# EAGLE design Arachnio (EAGLE 6.5.0)

## Sheet 1 of 4
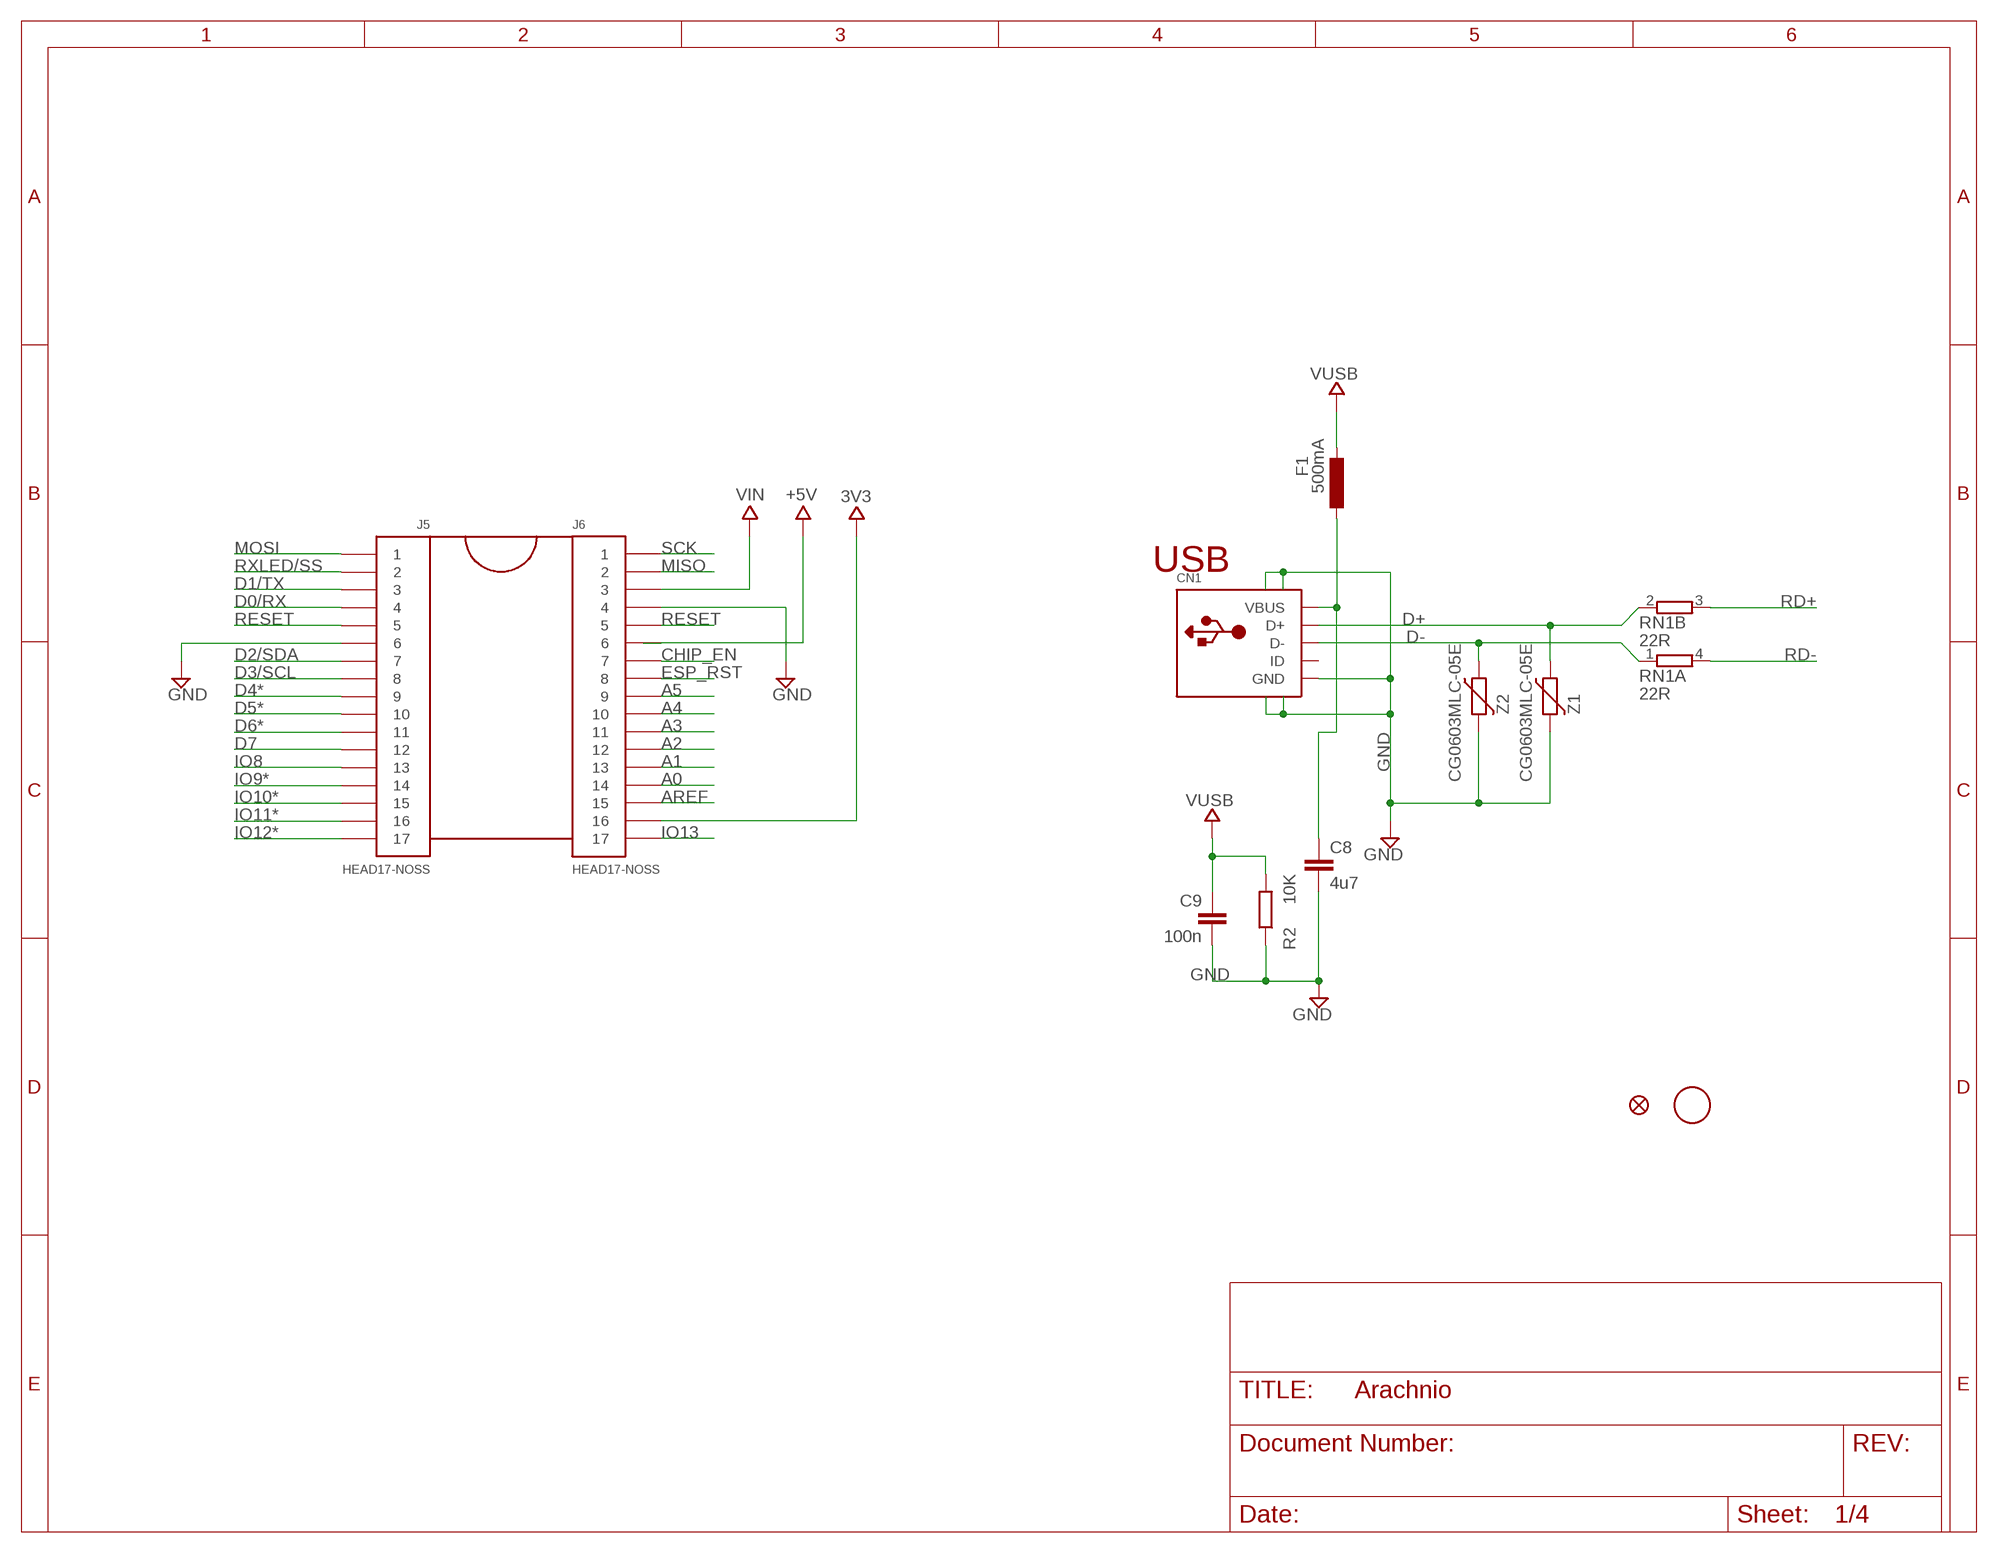
[diagram p0: schematic, sheet 1]

### Parts
C8  4u7  C-EUC0603  [C0603]
C9  100n  C-EUC0603  [C0603]
CN1  USBMINIB  [USB-MINIB]
F1  500mA  L-EUL1812  [L1812]
J5  HEAD17-NOSS  [HEAD17-NOSS]
J6  HEAD17-NOSS  HEAD17-NOSS-1  [HEAD17-NOSS-1]
R2  10K  R-EU_R0603  [R0603]
RN1  22R  2R-NEXBV4V  [EXBV4V]
U$37  FIDUCIALMOUNT  [FIDUCIA-MOUNT]
U$53  FIDUCIAL1X2  [FIDUCIAL-1X2]
Z1  CG0603MLC-05E  VARISTORCN0603  [CT/CN0603]
Z2  CG0603MLC-05E  VARISTORCN0603  [CT/CN0603]

### Nets
3V3: J6.16 ; also sheet 2,3,4
+5V: J6.6 ; also sheet 2,3
A0: J6.14 ; also sheet 2
A1: J6.13 ; also sheet 2
A2: J6.12 ; also sheet 2
A3: J6.11 ; also sheet 2
A4: J6.10 ; also sheet 2
A5: J6.9 ; also sheet 2
AREF: J6.15 ; also sheet 2
CHIP_EN: J6.7 ; also sheet 4
D0/RX: J5.4 ; also sheet 2,4
D1/TX: J5.3 ; also sheet 2,4
D2/SDA: J5.7 ; also sheet 2
D3/SCL: J5.8 ; also sheet 2,4
D4*: J5.9 ; also sheet 2
D5*: J5.10 ; also sheet 2
D6*: J5.11 ; also sheet 2
D7: J5.12 ; also sheet 2
D+: CN1.D+ RN1.2 Z1.1
D-: CN1.D- RN1.1 Z2.1
ESP_RST: J6.8 ; also sheet 4
GND: C8.2 C9.2 CN1.GND CN1.GND1(SHIELD) CN1.GND2(SHIELD) CN1.GND3(SHIELD) CN1.GND4(SHIELD) J5.6 J6.4 R2.1 Z1.2 Z2.2 ; also sheet 2,3,4
IO8: J5.13 ; also sheet 2
IO9*: J5.14 ; also sheet 2
IO10*: J5.15 ; also sheet 2
IO11*: J5.16 ; also sheet 2
IO12*: J5.17 ; also sheet 2
IO13: J6.17 ; also sheet 2
MISO: J6.2 ; also sheet 2
MOSI: J5.1 ; also sheet 2
RD+: RN1.3 ; also sheet 2
RD-: RN1.4 ; also sheet 2
RESET: J5.5 J6.5 ; also sheet 2,4
RXLED/SS: J5.2 ; also sheet 2
SCK: J6.1 ; also sheet 2
VIN: J6.3 ; also sheet 3
VUSB: C9.1 F1.2 R2.2 ; also sheet 2,3
VUSBD: C8.1 CN1.VBUS F1.1
Unconnected: CN1.ID

### Notes on the sheet
- USB

## Sheet 2 of 4
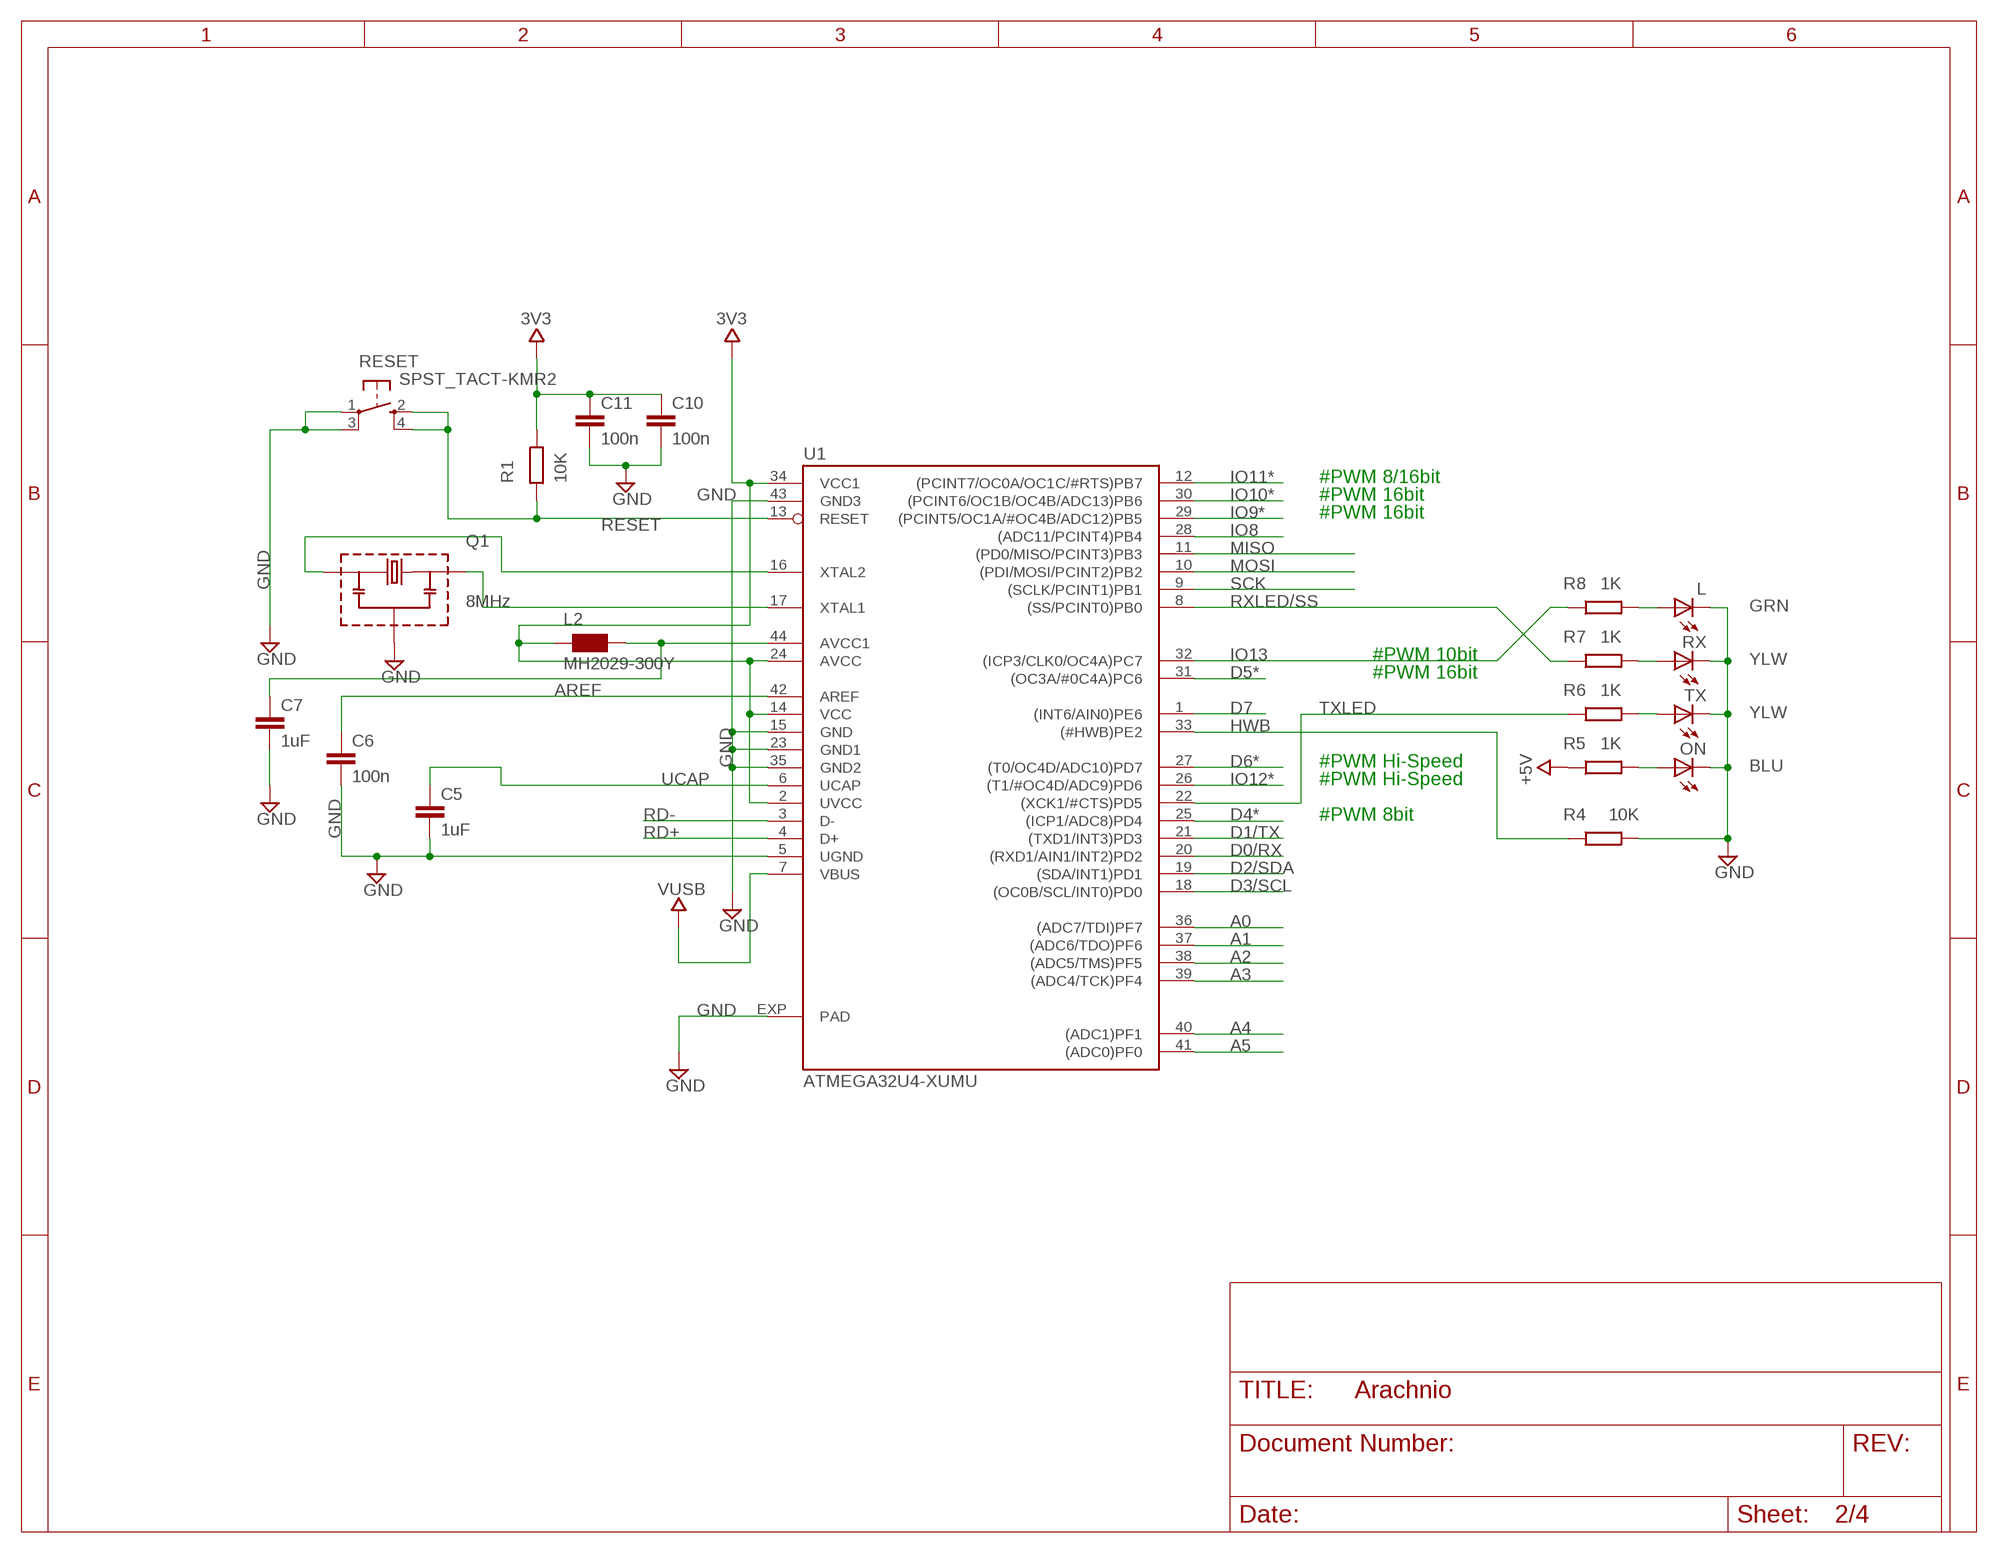
[diagram p1: schematic, sheet 2]

### Parts
C5  1uF  C-EUC0603  [C0603]
C6  100n  C-EUC0603  [C0603]
C7  1uF  C-EUC0603  [C0603]
C10  100n  C-EUC0603  [C0603]
C11  100n  C-EUC0603  [C0603]
L  GRN  LEDCHIP-LED0603  [CHIP-LED0603]
L2  MH2029-300Y  WE-CBF_0805  [0805]
ON  BLU  LEDCHIP-LED0603  [CHIP-LED0603]
Q1  8MHz  PRQC  [PRQC]
R1  10K  R-EU_R0603  [R0603]
R4  10K  R-EU_R0603  [R0603]
R5  1K  R-EU_R0603  [R0603]
R6  1K  R-EU_R0603  [R0603]
R7  1K  R-EU_R0603  [R0603]
R8  1K  R-EU_R0603  [R0603]
RESET  SPST_TACT-KMR2  [KMR2]
RX  YLW  LEDCHIP-LED0603  [CHIP-LED0603]
TX  YLW  LEDCHIP-LED0603  [CHIP-LED0603]
U1  ATMEGA32U4-XUMU  [QFN44ML7X7]

### Nets
3V3: C10.1 C11.1 L2.1 R1.1 U1.2(UVCC) U1.14(VCC) U1.24(AVCC) U1.34(VCC1) ; also sheet 1,3,4
+5V: R5.1 ; also sheet 1,3
A0: U1.36((ADC7/TDI)PF7) ; also sheet 1
A1: U1.37((ADC6/TDO)PF6) ; also sheet 1
A2: U1.38((ADC5/TMS)PF5) ; also sheet 1
A3: U1.39((ADC4/TCK)PF4) ; also sheet 1
A4: U1.40((ADC1)PF1) ; also sheet 1
A5: U1.41((ADC0)PF0) ; also sheet 1
AREF: C6.1 U1.42(AREF) ; also sheet 1
AVCC: C7.1 L2.2 U1.44(AVCC1)
D0/RX: U1.20((RXD1/AIN1/INT2)PD2) ; also sheet 1,4
D1/TX: U1.21((TXD1/INT3)PD3) ; also sheet 1,4
D2/SDA: U1.19((SDA/INT1)PD1) ; also sheet 1
D3/SCL: U1.18((OC0B/SCL/INT0)PD0) ; also sheet 1,4
D4*: U1.25((ICP1/ADC8)PD4) ; also sheet 1
D5*: U1.31((OC3A/#0C4A)PC6) ; also sheet 1
D6*: U1.27((T0/OC4D/ADC10)PD7) ; also sheet 1
D7: U1.1((INT6/AIN0)PE6) ; also sheet 1
GND: C5.2 C6.2 C7.2 C10.2 C11.2 L.C ON.C Q1.P$2 R4.2 RESET.1(P) RESET.3(P1) RX.C TX.C U1.5(UGND) U1.15(GND) U1.23(GND1) U1.35(GND2) U1.43(GND3) U1.EXP(PAD) ; also sheet 1,3,4
HWB: R4.1 U1.33((#HWB)PE2)
IO8: U1.28((ADC11/PCINT4)PB4) ; also sheet 1
IO9*: U1.29((PCINT5/OC1A/#OC4B/ADC12)PB5) ; also sheet 1
IO10*: U1.30((PCINT6/OC1B/OC4B/ADC13)PB6) ; also sheet 1
IO11*: U1.12((PCINT7/OC0A/OC1C/#RTS)PB7) ; also sheet 1
IO12*: U1.26((T1/#OC4D/ADC9)PD6) ; also sheet 1
IO13: R8.1 U1.32((ICP3/CLK0/OC4A)PC7) ; also sheet 1
MISO: U1.11((PD0/MISO/PCINT3)PB3) ; also sheet 1
MOSI: U1.10((PDI/MOSI/PCINT2)PB2) ; also sheet 1
N$2: R7.2 RX.A
N$3: ON.A R5.2
N$4: R6.2 TX.A
N$7: L.A R8.2
RD+: U1.4(D+) ; also sheet 1
RD-: U1.3(D-) ; also sheet 1
RESET: R1.2 RESET.2(S) RESET.4(S1) U1.13(RESET) ; also sheet 1,4
RXLED/SS: R7.1 U1.8((SS/PCINT0)PB0) ; also sheet 1
SCK: U1.9((SCLK/PCINT1)PB1) ; also sheet 1
TXLED: R6.1 U1.22((XCK1/#CTS)PD5)
UCAP: C5.1 U1.6(UCAP)
VUSB: U1.7(VBUS) ; also sheet 1,3
XTAL1: Q1.P$3 U1.17(XTAL1)
XTAL2: Q1.P$1 U1.16(XTAL2)

### Notes on the sheet
- #PWM 8/16bit
- #PWM 16bit
- #PWM 16bit
- #PWM 10bit
- #PWM 16bit
- #PWM Hi-Speed
- #PWM Hi-Speed
- #PWM 8bit

## Sheet 3 of 4
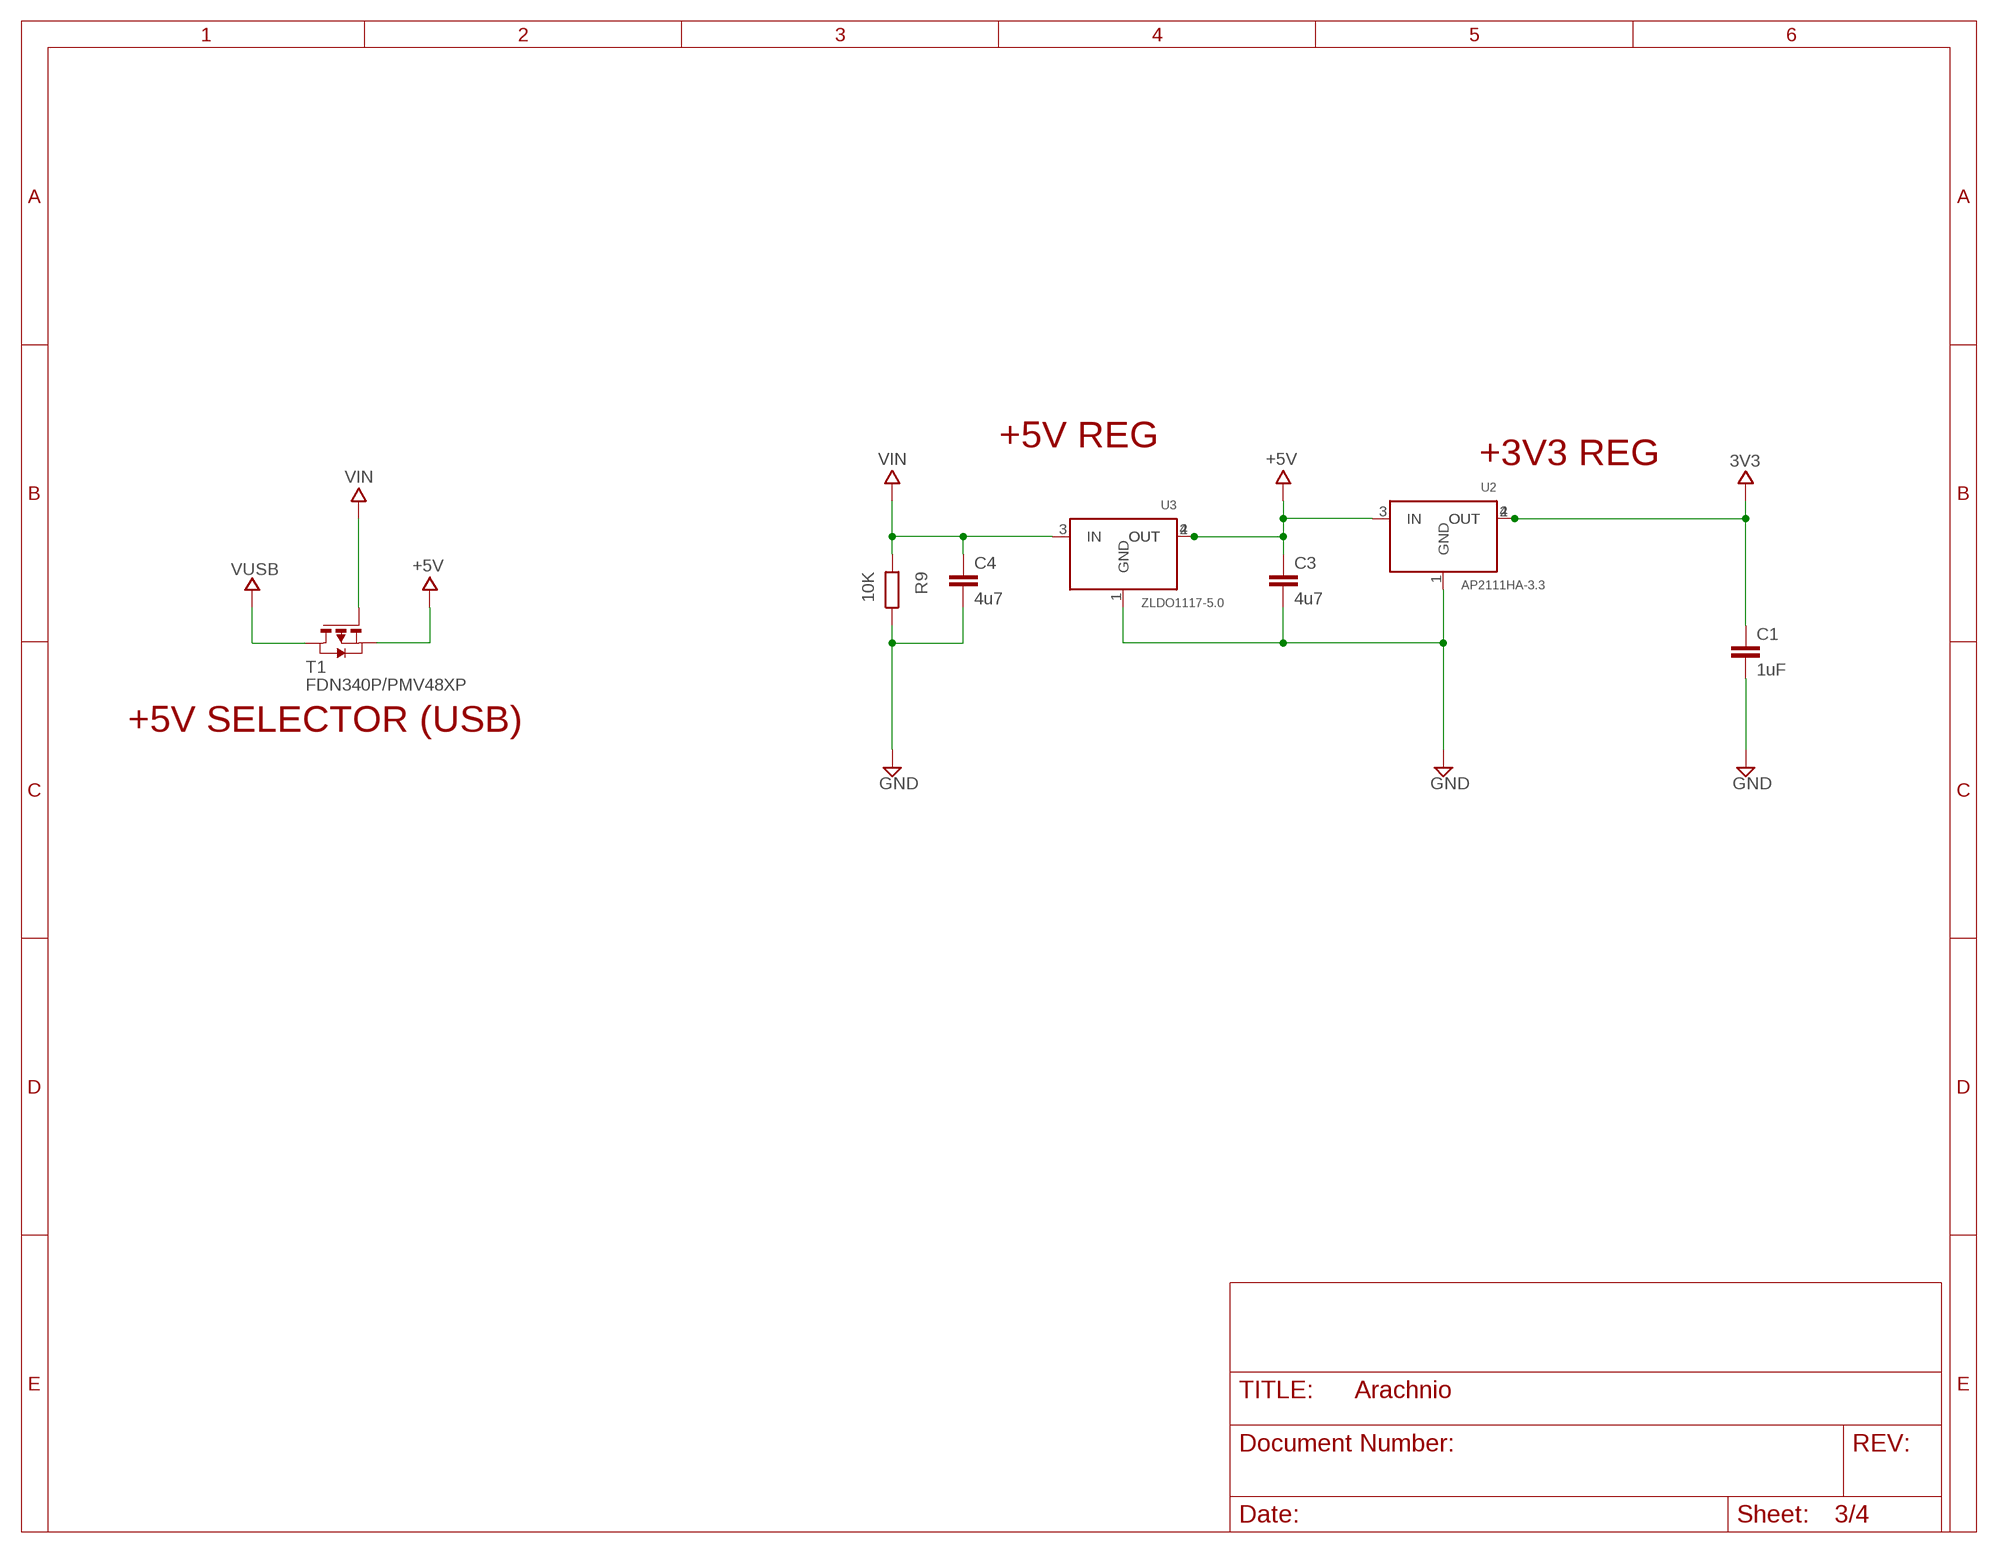
[diagram p2: schematic, sheet 3]

### Parts
C1  1uF  C-EUC0603  [C0603]
C3  4u7  C-EUC0603  [C0603]
C4  4u7  C-EUC0603  [C0603]
R9  10K  R-EU_R0603  [R0603]
T1  FDN340P/PMV48XP  PMOSSOT23  [SOT-23]
U2  AP2111HA-3.3  [SOT223]
U3  ZLDO1117-5.0  [SOT223]

### Nets
3V3: C1.1 U2.2(OUT) U2.4(OUT) ; also sheet 1,2,4
+5V: C3.1 T1.2(S) U2.3(IN) U3.2(OUT) U3.4(OUT) ; also sheet 1,2
GND: C1.2 C3.2 C4.2 R9.1 U2.1(GND) U3.1(GND) ; also sheet 1,2,4
VIN: C4.1 R9.2 T1.3(G) U3.3(IN) ; also sheet 1
VUSB: T1.1(D) ; also sheet 1,2

### Notes on the sheet
- +5V REG
- +3V3 REG
- +5V SELECTOR (USB)

## Sheet 4 of 4
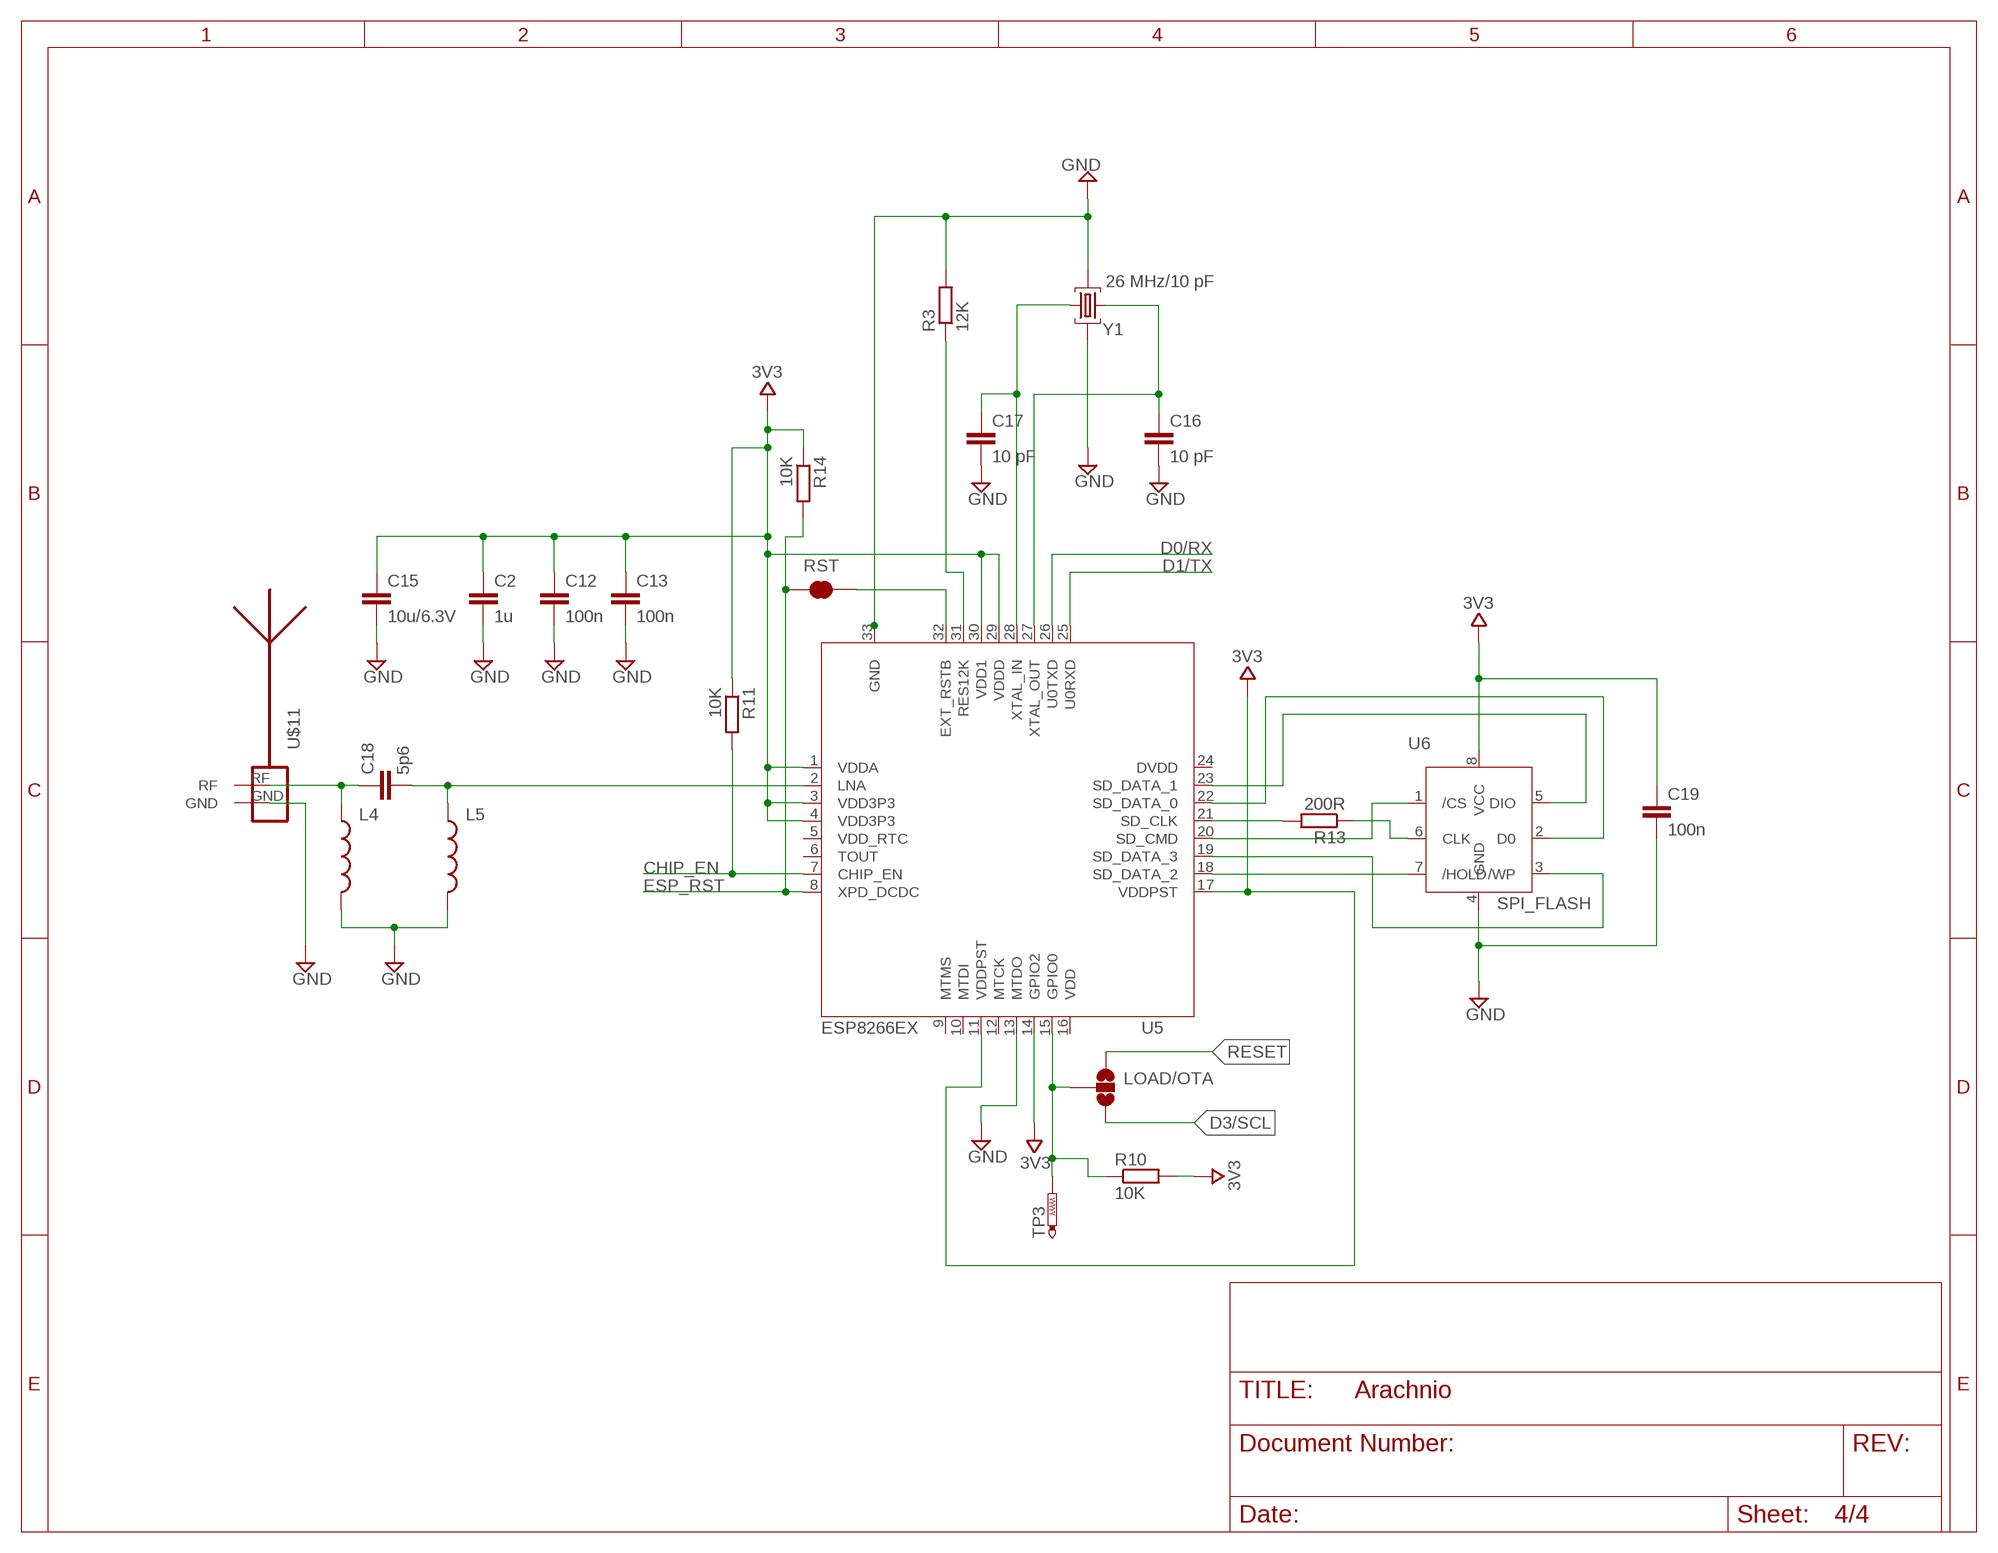
[diagram p3: schematic, sheet 4]

### Parts
C2  1u  C-EUC0603  [C0603]
C12  100n  C-EUC0603  [C0603]
C13  100n  C-EUC0603  [C0603]
C15  10u/6.3V  C-EUC0603  [C0603]
C16  10 pF  C-EUC0603  [C0603]
C17  10 pF  C-EUC0603  [C0603]
C18  5p6  C-EUC0603  [C0603]
C19  100n  C-EUC0603  [C0603]
L4  INDUCTOR0603  [0603]
L5  INDUCTOR0603  [0603]
LOAD/OTA  JUMPER-PAD-3-NOYES_SILK  [PAD-JUMPER-3-NO_YES_SILK]
R3  12K  R-EU_R0603  [R0603]
R10  10K  R-EU_R0603  [R0603]
R11  10K  R-EU_R0603  [R0603]
R13  200R  R-EU_R0603  [R0603]
R14  10K  R-EU_R0603  [R0603]
RST  JUMPER-PAD-2-NC_BY_TRACE  [PAD-JUMPER-2-NC_BY_TRACE_YES_SILK]
TP3  PTR1TP15SQ  [TP15SQ]
U5  ESP8266EX  [QFN32]
U6  SPI_FLASH  [SOIC-8]
U$11  ANTENNA_1RIGHT  [SWRA117D_RIGHT]
Y1  26 MHz/10 pF  CRYSTAL-3.2-2.5  [CRYSTAL-3.2-2.5]

### Nets
3V3: C2.1 C12.1 C13.1 C15.1 C19.1 R10.2 R11.1 R14.1 U5.1(VDDA) U5.3(VDD3P3) U5.4(VDD3P3) U5.11(VDDPST) U5.14(GPIO2) U5.17(VDDPST) U5.29(VDDD) U5.30(VDD1) U6.8(VCC) ; also sheet 1,2,3
CHIP_EN: R11.2 U5.7(CHIP_EN) ; also sheet 1
D0/RX: U5.26(U0TXD) ; also sheet 1,2
D1/TX: U5.25(U0RXD) ; also sheet 1,2
D3/SCL: LOAD/OTA.3 ; also sheet 1,2
ESP_RST: R14.2 RST.1 U5.8(XPD_DCDC) ; also sheet 1
GND: C2.2 C12.2 C13.2 C15.2 C16.2 C17.2 C19.2 L4.2 L5.2 R3.2 U5.13(MTDO) U5.33(GND) U6.4(GND) U$11.GND Y1.2(GND) Y1.4(GND) ; also sheet 1,2,3
N$6: LOAD/OTA.2 R10.1 TP3.TP U5.15(GPIO0)
N$27: C17.1 U5.28(XTAL_IN) Y1.1(C1)
N$28: C16.1 U5.27(XTAL_OUT) Y1.3(C2)
N$31: C18.1 L4.1 U$11.RF
N$32: R3.1 U5.31(RES12K)
N$33: RST.2 U5.32(EXT_RSTB)
N$34: R13.2 U5.21(SD_CLK)
N$35: R13.1 U6.6(CLK)
N$36: U5.20(SD_CMD) U6.1(/CS)
N$37: U5.18(SD_DATA_2) U6.7(/HOLD)
N$38: U5.19(SD_DATA_3) U6.3(/WP)
N$39: U5.23(SD_DATA_1) U6.5(DIO)
N$40: U5.22(SD_DATA_0) U6.2(D0)
N$45: C18.2 L5.1 U5.2(LNA)
RESET: LOAD/OTA.1 ; also sheet 1,2
Unconnected: U5.6(TOUT) U5.9(MTMS) U5.10(MTDI) U5.12(MTCK)

## Power pins joined to a net without a drawn wire
DVDD: U5.24(DVDD)
VDD: U5.16(VDD)
VDD_RTC: U5.5(VDD_RTC)

## Library data of the parts
C1 C2 C5 C7 = resistor:C-EU: CAPACITOR, European symbol; PARTNO: C0603C105K3PACTU
C3 C4 C8 = resistor:C-EU: CAPACITOR, European symbol; PARTNO: CL10A475KA8NQNC
C6 C9-C13 C19 = resistor:C-EU: CAPACITOR, European symbol; PARTNO: CC0603ZRY5V9BB104
C15 = resistor:C-EU: CAPACITOR, European symbol; PARTNO: JMK107ABJ106MAHT
C16 C17 = resistor:C-EU: CAPACITOR, European symbol; PARTNO: C0603C100K5GACTU
C18 = resistor:C-EU: CAPACITOR, European symbol; PARTNO: 251R14S5R6CV4T
CN1 = adafruit:USB: USB Connectors USBMINIB - Surface Mount Female Mini-B USB Connector 4UConnector: 06564 By microbuilder.eu Thru-hole RA Female Mini-B USB Connector 4UConnector: 18732 By ladyada.net; PARTNO: USB-M26FTR
F1 = rcl:L-EU: INDUCTOR, European symbol; PARTNO: MF-MSMF050-2
J5 = SmartPrj:HEAD17-NOSS; PARTNO: PREC017SAAN-RC
J6 = SmartPrj:HEAD17-NOSS-1; PARTNO: PREC017SAAN-RC
L = led:LED: LED OSRAM: - CHIPLED LG R971, LG N971, LY N971, LG Q971, LY Q971, LO R971, LY R971 LH N974, LH R974 LS Q976, LO Q976, LY Q976 LO Q996 - Hyper CHIPLED LW Q18S LB Q993, LB Q99A, LB R99A - SideLED LS A670, LO A670, LY A670, LG A670, LP A670 LB A673, LV A673, LT A673, LW A673 LH A674 LY A675 LS A676, LA A676, LO A676, LY A676, LW A676 LS A679, LY A679, LG A679 - Hyper Micro SIDELED® LS Y876, LA Y876, LO Y876, LY Y876 LT Y87S - SmartLED LW L88C, LW L88S LB L89C, LB L89S, LG L890 LS L89K, LO L89K, LY L89K LS L896, LA L896, LO L896, LY L896 - TOPLED LS T670, LO T670, LY T670, LG T670, LP T670 LSG T670, LSP T670, LSY T670, LOP T670, LYG T670 LG T671, LOG T671, LSG T671 LB T673, LV T673, LT T673, LW T673 LH T674 LS T676, LA T676, LO T676, LY T676, LB T676, LH T676, LSB T676, LW T676 LB T67C, LV T67C, LT T67C, LS T67K, LO T67K, LY T67K, LW E67C LS E67B, LA E67B, LO E67B, LY E67B, LB E67C, LV E67C, LT E67C LW T67C LS T679, LY T679, LG T679 LS T770, LO T770, LY T770, LG T770, LP T770 LB T773, LV T773, LT T773, LW T773 LH T774 LS E675, LA E675, LY E675, LS T675 LS T776, LA T776, LO T776, LY T776, LB T776 LHGB T686 LT T68C, LB T68C - Hyper Mini TOPLED® LB M676 - Mini TOPLED Santana® LG M470 LS M47K, LO M47K, LY M47K Source: http://www.osram.convergy.de LUXEON: - LUMILED® LXK2-PW12-R00, LXK2-PW12-S00, LXK2-PW14-U00, LXK2-PW14-V00 LXK2-PM12-R00, LXK2-PM12-S00, LXK2-PM14-U00 LXK2-PE12-Q00, LXK2-PE12-R00, LXK2-PE12-S00, LXK2-PE14-T00, LXK2-PE14-U00 LXK2-PB12-K00, LXK2-PB12-L00, LXK2-PB12-M00, LXK2-PB14-N00, LXK2-PB14-P00, LXK2-PB14-Q00 LXK2-PR12-L00, LXK2-PR12-M00, LXK2-PR14-Q00, LXK2-PR14-R00 LXK2-PD12-Q00, LXK2-PD12-R00, LXK2-PD12-S00 LXK2-PH12-R00, LXK2-PH12-S00 LXK2-PL12-P00, LXK2-PL12-Q00, LXK2-PL12-R00 Source: www.luxeon.com KINGBRIGHT: KA-3528ASYC Source: www.kingbright.com; PARTNO: LTST-C191KGKT
L2 = wuerth-elektronik:WE-CBF: SMD EMI Suppression Ferrite Beads - excellent anti-EMI properties - low DCR - impedances till 3000 ohms - rated current up to 6 A; PARTNO: MH2029-300Y
L4 L5 = SparkFun-Passives:INDUCTOR: Inductors Basic Inductor/Choke - 0603 and 1206. Footprints are not proven and vary greatly between part numbers. SRN6045- 33uH, 20% 1.4A SDR0403-560KL - 56uH, 10%, 500mA RMS/740mA peak; BOM: EXCLUDE
LOAD/OTA = SparkFun-Passives:JUMPER-PAD-3-NO
ON = led:LED: LED OSRAM: - CHIPLED LG R971, LG N971, LY N971, LG Q971, LY Q971, LO R971, LY R971 LH N974, LH R974 LS Q976, LO Q976, LY Q976 LO Q996 - Hyper CHIPLED LW Q18S LB Q993, LB Q99A, LB R99A - SideLED LS A670, LO A670, LY A670, LG A670, LP A670 LB A673, LV A673, LT A673, LW A673 LH A674 LY A675 LS A676, LA A676, LO A676, LY A676, LW A676 LS A679, LY A679, LG A679 - Hyper Micro SIDELED® LS Y876, LA Y876, LO Y876, LY Y876 LT Y87S - SmartLED LW L88C, LW L88S LB L89C, LB L89S, LG L890 LS L89K, LO L89K, LY L89K LS L896, LA L896, LO L896, LY L896 - TOPLED LS T670, LO T670, LY T670, LG T670, LP T670 LSG T670, LSP T670, LSY T670, LOP T670, LYG T670 LG T671, LOG T671, LSG T671 LB T673, LV T673, LT T673, LW T673 LH T674 LS T676, LA T676, LO T676, LY T676, LB T676, LH T676, LSB T676, LW T676 LB T67C, LV T67C, LT T67C, LS T67K, LO T67K, LY T67K, LW E67C LS E67B, LA E67B, LO E67B, LY E67B, LB E67C, LV E67C, LT E67C LW T67C LS T679, LY T679, LG T679 LS T770, LO T770, LY T770, LG T770, LP T770 LB T773, LV T773, LT T773, LW T773 LH T774 LS E675, LA E675, LY E675, LS T675 LS T776, LA T776, LO T776, LY T776, LB T776 LHGB T686 LT T68C, LB T68C - Hyper Mini TOPLED® LB M676 - Mini TOPLED Santana® LG M470 LS M47K, LO M47K, LY M47K Source: http://www.osram.convergy.de LUXEON: - LUMILED® LXK2-PW12-R00, LXK2-PW12-S00, LXK2-PW14-U00, LXK2-PW14-V00 LXK2-PM12-R00, LXK2-PM12-S00, LXK2-PM14-U00 LXK2-PE12-Q00, LXK2-PE12-R00, LXK2-PE12-S00, LXK2-PE14-T00, LXK2-PE14-U00 LXK2-PB12-K00, LXK2-PB12-L00, LXK2-PB12-M00, LXK2-PB14-N00, LXK2-PB14-P00, LXK2-PB14-Q00 LXK2-PR12-L00, LXK2-PR12-M00, LXK2-PR14-Q00, LXK2-PR14-R00 LXK2-PD12-Q00, LXK2-PD12-R00, LXK2-PD12-S00 LXK2-PH12-R00, LXK2-PH12-S00 LXK2-PL12-P00, LXK2-PL12-Q00, LXK2-PL12-R00 Source: www.luxeon.com KINGBRIGHT: KA-3528ASYC Source: www.kingbright.com; PARTNO: LB Q39G-L2N2-35-1
Q1 = logos-crystals:PRQC: PRQC series resonator from Kyocera; PARTNO: PRQC8.00CR1010V00L
R1 R2 R4 R9-R11 R14 = resistor:R-EU_: RESISTOR, European symbol; PARTNO: RNCP0603FTD10K0
R3 = resistor:R-EU_: RESISTOR, European symbol; PARTNO: RMCF0603FT12K0
R5-R8 = resistor:R-EU_: RESISTOR, European symbol; PARTNO: RMCF0603FT1K00
R13 = resistor:R-EU_: RESISTOR, European symbol; PARTNO: MCR03ERTJ201
RESET = adafruit:SPST_TACT: SMT 6mm switch, EVQQ2 series http://www.ladyada.net/library/eagle; PARTNO: KMR221NG
RN1 = res-cap-arrays:2R-N: Array Chip Resistor Source: Panasonic; PARTNO: EXB-V4V220JV
RST = SparkFun-Passives:JUMPER-PAD-2-NC_BY_TRACE
RX TX = led:LED: LED OSRAM: - CHIPLED LG R971, LG N971, LY N971, LG Q971, LY Q971, LO R971, LY R971 LH N974, LH R974 LS Q976, LO Q976, LY Q976 LO Q996 - Hyper CHIPLED LW Q18S LB Q993, LB Q99A, LB R99A - SideLED LS A670, LO A670, LY A670, LG A670, LP A670 LB A673, LV A673, LT A673, LW A673 LH A674 LY A675 LS A676, LA A676, LO A676, LY A676, LW A676 LS A679, LY A679, LG A679 - Hyper Micro SIDELED® LS Y876, LA Y876, LO Y876, LY Y876 LT Y87S - SmartLED LW L88C, LW L88S LB L89C, LB L89S, LG L890 LS L89K, LO L89K, LY L89K LS L896, LA L896, LO L896, LY L896 - TOPLED LS T670, LO T670, LY T670, LG T670, LP T670 LSG T670, LSP T670, LSY T670, LOP T670, LYG T670 LG T671, LOG T671, LSG T671 LB T673, LV T673, LT T673, LW T673 LH T674 LS T676, LA T676, LO T676, LY T676, LB T676, LH T676, LSB T676, LW T676 LB T67C, LV T67C, LT T67C, LS T67K, LO T67K, LY T67K, LW E67C LS E67B, LA E67B, LO E67B, LY E67B, LB E67C, LV E67C, LT E67C LW T67C LS T679, LY T679, LG T679 LS T770, LO T770, LY T770, LG T770, LP T770 LB T773, LV T773, LT T773, LW T773 LH T774 LS E675, LA E675, LY E675, LS T675 LS T776, LA T776, LO T776, LY T776, LB T776 LHGB T686 LT T68C, LB T68C - Hyper Mini TOPLED® LB M676 - Mini TOPLED Santana® LG M470 LS M47K, LO M47K, LY M47K Source: http://www.osram.convergy.de LUXEON: - LUMILED® LXK2-PW12-R00, LXK2-PW12-S00, LXK2-PW14-U00, LXK2-PW14-V00 LXK2-PM12-R00, LXK2-PM12-S00, LXK2-PM14-U00 LXK2-PE12-Q00, LXK2-PE12-R00, LXK2-PE12-S00, LXK2-PE14-T00, LXK2-PE14-U00 LXK2-PB12-K00, LXK2-PB12-L00, LXK2-PB12-M00, LXK2-PB14-N00, LXK2-PB14-P00, LXK2-PB14-Q00 LXK2-PR12-L00, LXK2-PR12-M00, LXK2-PR14-Q00, LXK2-PR14-R00 LXK2-PD12-Q00, LXK2-PD12-R00, LXK2-PD12-S00 LXK2-PH12-R00, LXK2-PH12-S00 LXK2-PL12-P00, LXK2-PL12-Q00, LXK2-PL12-R00 Source: www.luxeon.com KINGBRIGHT: KA-3528ASYC Source: www.kingbright.com; PARTNO: LTST-C191KSKT
T1 = zetex:PMOSSOT23: MOS FET; PARTNO: FDN340P
TP3 = testpad:PTR1: TEST PIN; BOM: EXCLUDE
U1 = SmartPrj:ATMEGA32U4-XU; PARTNO: ATMEGA32U4-MU
U2 = logos-power:AP2111HA; PARTNO: AP2111H-3.3TRG1
U3 = logos-power:ZLDO1117; PARTNO: ZLDO1117G50TA
U5 = ESP8266:ESP8266: 802.11bgn Smart Device; PARTNO: ESP8266EX
U6 = ESP8266:SPI_FLASH: SPI Flash; PARTNO: SST25VF512A-33-4C-SAE
U$11 = ant-planar-1:ANTENNA_1; BOM: EXCLUDE; PARTNO: *
U$37 = SmartPrj:FIDUCIALMOUNT; BOM: EXCLUDE
U$53 = SparkFun:FIDUCIAL: Fiducial Alignment Points Various fiducial points for machine vision alignment.; BOM: EXCLUDE
Y1 = SmartPrj:CRYSTAL-3.2-2.5; PARTNO: 403C11A26M00000
Z1 Z2 = varistor:VARISTOR: VARISTOR; PARTNO: CG0603MLC-05E

## Net classes
0 default: width 0.152 mm, drill 0.33 mm, clearance 0.152 mm

## Board
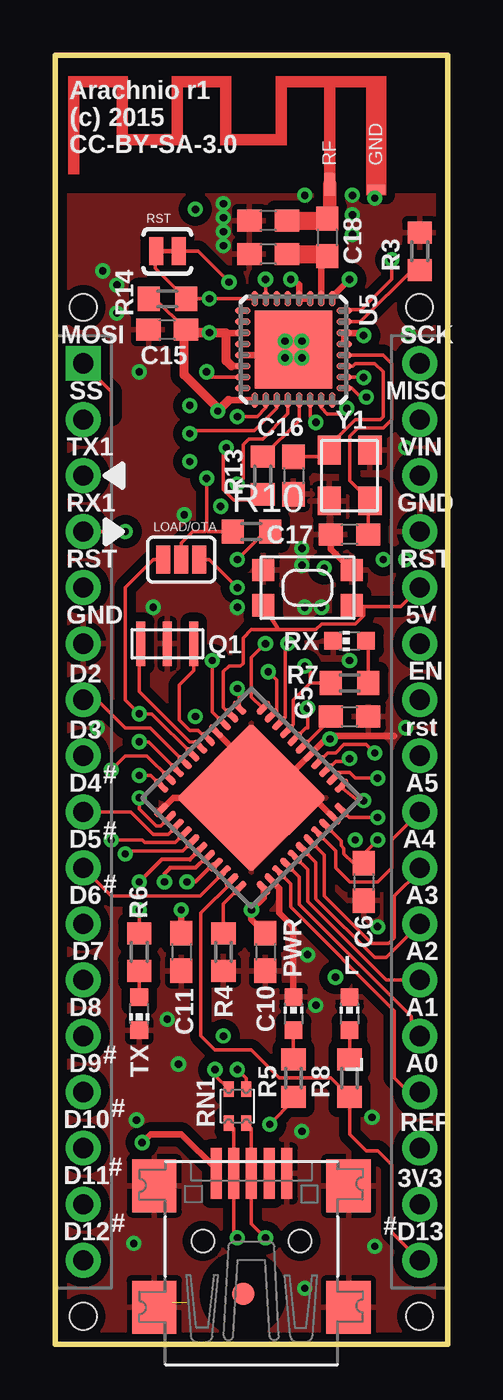
[diagram p4: board, top side]
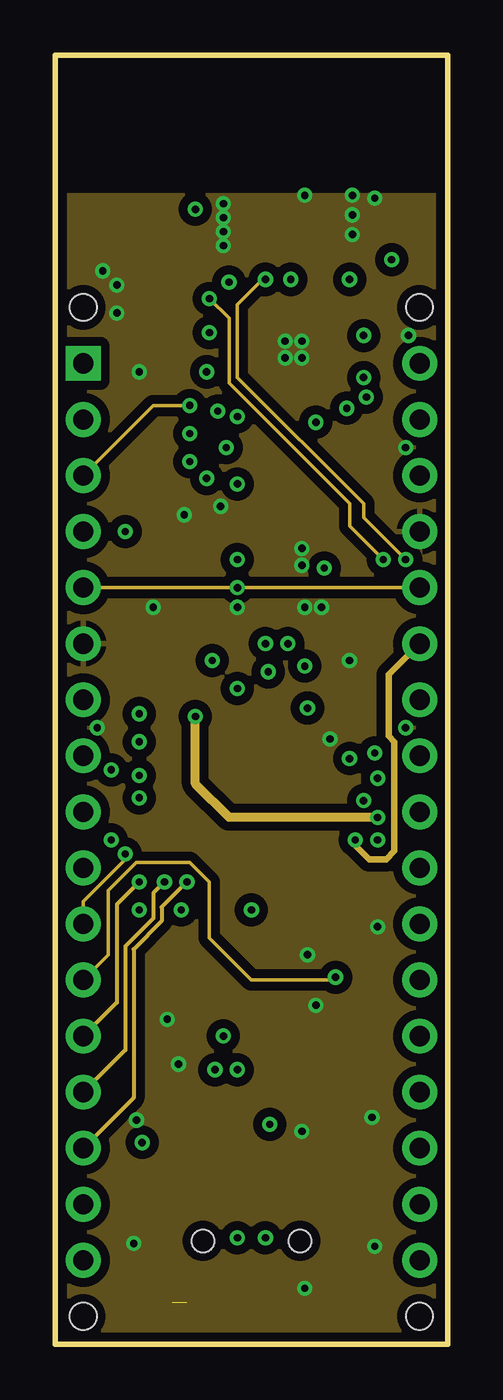
[diagram p5: board, inner layer GND]
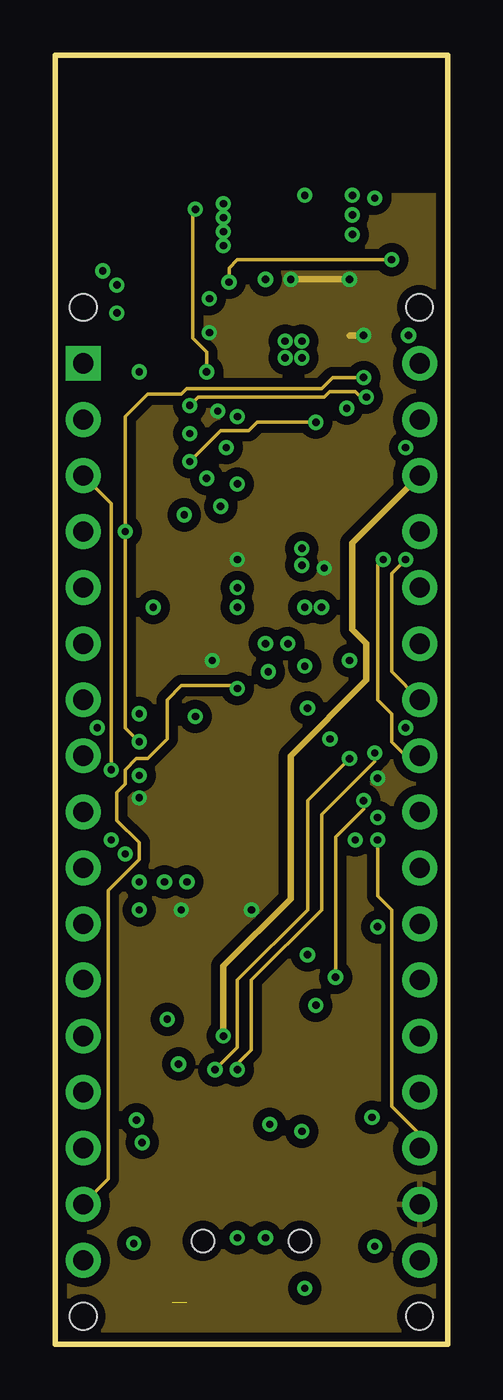
[diagram p6: board, inner layer PWR]
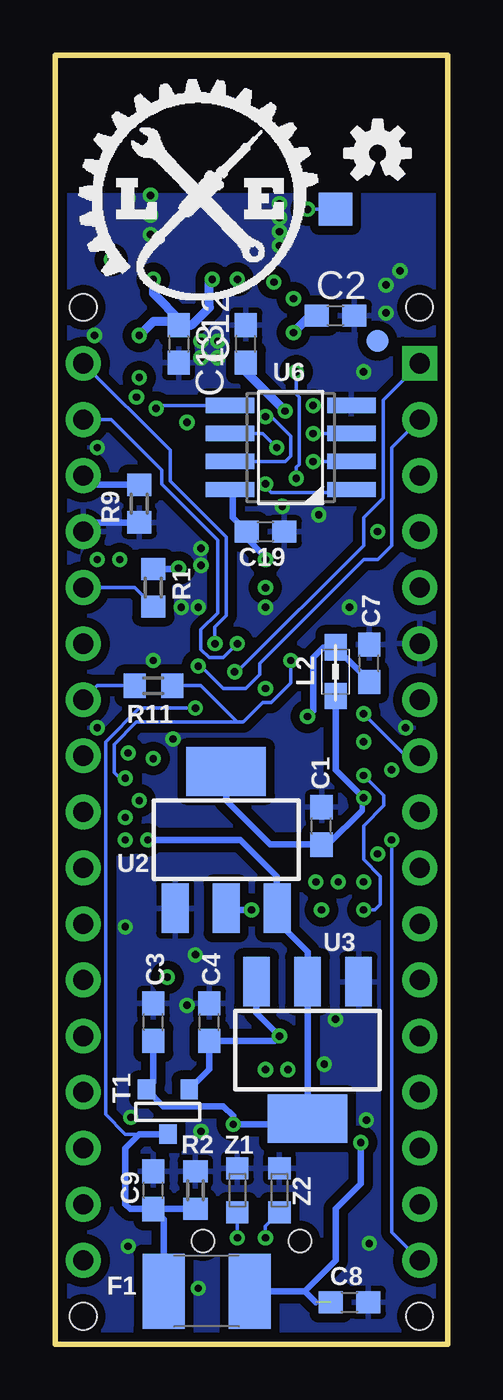
[diagram p7: board, bottom side, seen from below]

Size 17.78 x 58.42 mm. Coordinates in mm from the lower left corner, seen from the top.
Outline: 0,0 17.78,0 17.78,58.42 0,58.42 0,0
Copper layers (1*2*15*16): Top 0.0356mm / dielectric 1.5011mm / GND 0.0356mm / dielectric 0.1499mm / PWR 0.0356mm / dielectric 0.2007mm / Bottom 0.0356mm
Design rules "LaenPCBOrder *": minimum track width 6mil, minimum drill 13mil, track to track 6mil, track to pad 6mil, pad to pad 6mil, via to via 6mil, smd to smd 6mil, copper to edge 15mil, drill to drill 6mil, minimum pad ring 7mil, minimum via ring 7mil, stop-mask expansion 4mil, vias tented up to drill 15mil, thermal gap 10mil
Holes 1.2 mm at 1.27,1.27 16.51,1.27 1.27,46.99 16.51,46.99

### Footprints (pad centres in the part's own frame; a part is rotated, then mirrored left to right if it is on the bottom)
C0603 = smd 1.1 x 1: 1 -0.85,0; 2 0.85,0
USB-MINIB = smd 0.5 x 2.308: D+ 0,4.064; D- -0.8,4.064; GND 1.6,4.064; ID 0.8,4.064; VBUS -1.6,4.064 | smd 2 x 2.4: GND1 -4.4,-2; GND2 -4.4,3.5; GND3 4.4,3.5; GND4 4.4,-2 | hole 1: -2.2,1; 2.2,1
L1812 = smd 1.9 x 3.4: 1 -1.95,0; 2 1.95,0
HEAD17-NOSS = drill 0.914 pad 1.575 square: 1 0,0 | drill 0.914 pad 1.575: 2 2.54,0; 3 5.08,0; 4 7.62,0; 5 10.16,0; 6 12.7,0; 7 15.24,0; 8 17.78,0; 9 20.32,0; 10 22.86,0; 11 25.4,0; 12 27.94,0; 13 30.48,0; 14 33.02,0; 15 35.56,0; 16 38.1,0; 17 40.64,0
HEAD17-NOSS-1 = drill 0.914 pad 1.575: 1 0,0; 2 2.54,0; 3 5.08,0; 4 7.62,0; 5 10.16,0; 6 12.7,0; 7 15.24,0; 8 17.78,0; 9 20.32,0; 10 22.86,0; 11 25.4,0; 12 27.94,0; 13 30.48,0; 14 33.02,0; 15 35.56,0; 16 38.1,0; 17 40.64,0
CHIP-LED0603 = smd 0.8 x 0.8: A 0,-0.75; C 0,0.75
0805 = smd 1.2 x 1: 1 -1.1,0; 2 1.1,0
0603 = smd 1.1 x 1: 1 -0.85,0; 2 0.85,0
PAD-JUMPER-3-NO_YES_SILK = smd 0.635 x 1.27: 1 -0.813,0; 2 0,0; 3 0.813,0
PRQC = smd 0.4 x 2: P$1 -1.2,0; P$2 0,0; P$3 1.2,0
R0603 = smd 1 x 1.1: 1 -0.85,0; 2 0.85,0
KMR2 = smd 1 x 1: 1 2,0.8; 2 2,-0.8; 3 -2,0.8; 4 -2,-0.8
EXBV4V = smd 0.45 x 0.7: 1 -0.4,-0.775; 2 0.4,-0.775; 3 0.4,0.775; 4 -0.4,0.775
PAD-JUMPER-2-NC_BY_TRACE_YES_SILK = smd 0.635 x 1.27: 1 -0.508,0; 2 0.508,0
SOT-23 = smd 0.787 x 0.889: 1 0.025,-1.016; 2 -0.94,1.016; 3 0.991,1.016
TP15SQ = smd 1.5 x 1.5: TP 0,0
QFN44ML7X7 = smd 0.75 x 0.275: 1 -3.275,2.5; 2 -3.275,2; 3 -3.275,1.5; 4 -3.275,1; 5 -3.275,0.5; 6 -3.275,0; 7 -3.275,-0.5; 8 -3.275,-1; 9 -3.275,-1.5; 10 -3.275,-2; 11 -3.275,-2.5; 23 3.275,-2.5; 24 3.275,-2; 25 3.275,-1.5; 26 3.275,-1; 27 3.275,-0.5; 28 3.275,0; 29 3.275,0.5; 30 3.275,1; 31 3.275,1.5; 32 3.275,2; 33 3.275,2.5 | smd 0.275 x 0.75: 12 -2.5,-3.275; 13 -2,-3.275; 14 -1.5,-3.275; 15 -1,-3.275; 16 -0.5,-3.275; 17 0,-3.275; 18 0.5,-3.275; 19 1,-3.275; 20 1.5,-3.275; 21 2,-3.275; 22 2.5,-3.275; 34 2.5,3.275; 35 2,3.275; 36 1.5,3.275; 37 1,3.275; 38 0.5,3.275; 39 0,3.275; 40 -0.5,3.275; 41 -1,3.275; 42 -1.5,3.275; 43 -2,3.275; 44 -2.5,3.275 | smd 4.826 x 4.826: EXP 0,0
SOT223 = smd 1.219 x 2.235: 1 -2.311,-3.099; 2 0,-3.099; 3 2.311,-3.099 | smd 3.6 x 2.2: 4 0,3.099
QFN32 = smd 0.7 x 0.3: 1 -2.3,1.75; 2 -2.3,1.25; 3 -2.3,0.75; 4 -2.3,0.25; 5 -2.3,-0.25; 6 -2.3,-0.75; 7 -2.3,-1.25; 8 -2.3,-1.75; 17 2.3,-1.75; 18 2.3,-1.25; 19 2.3,-0.75; 20 2.3,-0.25; 21 2.3,0.25; 22 2.3,0.75; 23 2.3,1.25; 24 2.3,1.75 | smd 0.3 x 0.7: 9 -1.75,-2.3; 10 -1.25,-2.3; 11 -0.75,-2.3; 12 -0.25,-2.3; 13 0.25,-2.3; 14 0.75,-2.3; 15 1.25,-2.3; 16 1.75,-2.3; 25 1.75,2.3; 26 1.25,2.3; 27 0.75,2.3; 28 0.25,2.3; 29 -0.25,2.3; 30 -0.75,2.3; 31 -1.25,2.3; 32 -1.75,2.3 | smd 3.53 x 3.53: 33 0,0
SOIC-8 = smd 0.7 x 2.2: 1 -1.905,-2.75; 2 -0.635,-2.75; 3 0.635,-2.75; 4 1.905,-2.75; 5 1.905,2.75; 6 0.635,2.75; 7 -0.635,2.75; 8 -1.905,2.75
SWRA117D_RIGHT = smd 0.813 x 0.406: GND -0.45,0.25 | smd 0.508 x 1.016: RF -2.55,0.5
FIDUCIA-MOUNT = smd 1.016 x 1.016: P$1 0,0
FIDUCIAL-1X2 = smd 1 x 1: 1 0,0
CRYSTAL-3.2-2.5 = smd 1.3 x 1.05: 1 -1.15,-0.925; 2 1.15,-0.925; 3 1.15,0.925; 4 -1.15,0.925
CT/CN0603 = smd 1 x 1: 1 -1,0; 2 1,0

### Placement (x,y rotation side)
C1  5.71,23.5 90 bottom
C2  5.08,46.61 0 bottom
C3  13.34,14.61 90 bottom
C4  10.79,14.61 90 bottom
C5  13.34,28.45 0 top
C6  13.97,20.95 270 top
C7  3.56,30.86 90 bottom
C8  4.45,1.91 0 bottom
C9  13.34,6.99 90 bottom
C10  9.53,17.78 270 top
C11  5.71,17.78 270 top
C12  9.14,45.34 90 bottom
C13  12.19,45.34 270 bottom
C15  5.08,45.97 180 top
C16  10.79,39.37 270 top
C17  13.34,36.7 180 top
C18  12.32,50.16 270 top
C19  8.26,36.83 0 bottom
CN1  8.89,3.68 0 top
F1  10.92,2.41 180 bottom
J5  1.27,44.45 270 top
J6  16.51,44.45 270 top
L  13.34,14.99 0 top
L2  5.08,30.48 90 bottom
L4  9.65,50.93 180 top
L5  9.65,49.4 180 top
LOAD/OTA  5.71,35.56 180 top
ON  10.79,14.99 0 top
Q1  5.08,31.75 180 top
R1  13.34,34.29 270 bottom
R2  11.43,6.99 270 bottom
R3  16.51,49.53 90 top
R4  7.62,17.78 270 top
R5  10.79,12.06 90 top
R6  3.81,17.78 270 top
R7  13.34,29.97 0 top
R8  13.34,12.06 90 top
R9  13.97,38.1 90 bottom
R10  8.89,36.83 0 top
R11  13.34,29.84 180 bottom
R13  9.4,39.37 90 top
R14  5.08,47.37 0 top
RESET  11.43,34.29 0 top
RN1  8.26,10.79 0 top
RST  5.08,49.53 0 top
RX  13.34,31.88 90 top
T1  12.7,10.54 0 bottom
TP3  5.08,51.44 270 bottom
TX  3.81,14.99 180 top
U1  8.89,24.77 225 top
U2  10.03,22.86 0 bottom
U3  6.35,13.34 180 bottom
U5  10.79,45.09 270 top
U6  7.11,40.64 90 bottom
U$1  [LOGO-SM]  17.14,46.99 0 bottom
U$11  14.99,52.07 0 top
U$12  [OSHW-LOGO-S]  3.17,53.98 0 bottom
U$37  8.51,2.29 0 top
U$53  3.17,45.47 0 bottom
Y1  13.34,39.37 90 top
Z1  9.53,6.99 90 bottom
Z2  7.62,6.99 90 bottom

### Tracks (layer width: path | path; a pad name or v marks a point on that pad's centre or on a via)
3V3  (via drill 0.33)
  Top 0.152: U1.24 4.79,23.5 4.57,23.5 3.81,24.26 v3.81,24.77 | U1.14 7.11,28.66 v7.11,30.99 | 14.59,25.67 v14.61,25.65 13.59,25.65 13.34,25.91 12.86,25.91 U1.2 | R14.1 4.53,47.37 C15.1 | R10.2 9.53,36.83 v8.26,35.56
  Top 0.305: U5.3 U5.4 11.04,48.01 v10.67,48.26 | C10.1 8.89,19.27 v8.89,19.68 9.44,20.23 U1.34 | C11.1 v5.71,19.68 | U5.29 U5.30 13.86,45.84 v13.97,45.72 | U5.11 7.75,45.84 | 6.33,45.85 6.32,45.84 C15.1 5.97,45.94 5.8,46.06 5.84,46.1 | U5.1 12.54,47.47 v13.34,48.26 | U5.17 7.86,42.78 | 7.37,42.42 v7.37,42.29 | U5.14 7.99,44.34
  Top 0.406: 6.32,45.84 7.75,45.84 7.75,44.58 7.99,44.34 | v6.99,45.85 6.33,45.85 | 7.86,42.78 v7.37,42.29 | 7.37,42.42 5.84,43.94 5.84,46.1
  PWR 0.305: v13.34,48.26 v10.67,48.26 | v13.97,45.72 13.34,45.72
  Bottom 0.152: v7.11,30.99 7.11,29.97 8,29.08 8.38,29.08 9.27,28.19 9.53,28.19 | v14.61,25.65 14.86,25.65 15.11,25.91 15.11,27.18 14.1,28.19 9.53,28.19 | R11.1 11.18,29.84 9.53,28.19
  Bottom 0.254: C1.1 5.42,22.64 3.87,24.19 3.87,24.7 v3.81,24.77
  Bottom 0.305: U6.8 9.73,38.73 9.73,37.46 C19.1 9.14,36.58 8.26,35.69 v8.26,35.56 | R1.1 12.48,35.14 v12.19,35.18 | L2.1 5.08,26.04 v3.81,24.77 | v8.89,19.68 9.7,19.68 U2.2 | C1.1 8.04,22.64 10.03,24.64 U2.4
  Bottom 0.406: C12.1 9.14,44.07 v7.37,42.29 | C2.1 6.22,46.61 v6.99,45.85 | C13.1 11.6,46.19 10.79,46.99 10.79,48.13 v10.67,48.26 | v13.34,48.26 13.34,47.62 12.06,46.35 13.34,46.35 v13.97,45.72
  pour PWR (isolate 0.406): -1.27,52.07 19.05,52.07 19.05,-1.27 -1.27,-1.27
+5V  (via drill 0.33)
  Top 0.152: R5.1 10.79,11.05 v9.72,9.97
  GND 0.305: v13.59,22.86 13.59,22.61 14.22,21.97 14.99,21.97 15.37,22.35 15.37,27.3 15.11,27.56 15.11,30.35 J6.6
  Bottom 0.305: C3.1 13.34,11.86 T1.2 12.88,10.79 10.16,10.79 9.72,10.35 v9.72,9.97 6.62,9.97 U3.4 U3.2 6.35,17.78 7.75,19.18 U2.3 7.75,21.21 9.4,22.86 v13.59,22.86
A0
  Top 0.152: J6.14 16,11.43 15.37,12.06 15.37,15.11 10.67,19.81 10.67,20.87 U1.36
A1
  Top 0.152: J6.13 16.13,13.97 16.13,14.86 11.05,19.94 11.05,21.19 U1.37
A2
  Top 0.152: U1.38 11.43,21.52 11.43,20.07 14.99,16.51 J6.12
A3
  Top 0.152: U1.39 11.81,21.84 11.81,20.19 14.48,17.53 14.99,17.53 J6.11
A4
  Top 0.152: U1.40 12.19,22.17 12.19,20.32 14.35,18.16 15.11,18.16 15.37,18.41 15.37,20.32 16.51,21.46 J6.10
A5
  Top 0.152: U1.41 12.7,22.37 12.7,21.59 13.34,20.95 14.61,20.95 15.24,21.59 15.24,22.86 J6.9
AREF  (via drill 0.33)
  Top 0.152: v14.61,22.86 13.97,22.23 C6.1 13.5,21.8 13.08,22.23 13.08,22.48 12.95,22.61 12.95,22.82 U1.42
  PWR 0.152: v14.61,22.86 14.61,20.32 15.24,19.68 15.24,10.79 16.51,9.53 J6.15
AVCC  (via drill 0.33)
  Top 0.152: U1.44 13.31,23.88 v14.61,23.88
  GND 0.406: v14.61,23.88 7.87,23.88 6.35,25.4 v6.35,28.45
  Bottom 0.152: L2.2 5.25,31.58
  Bottom 0.305: C7.1 3.56,30.06 L2.2 5.63,31.58 6.1,31.11 6.1,28.7 v6.35,28.45
CHIP_EN  (via drill 0.33)
  Top 0.152: U5.7 9.54,48.24 v9.53,48.26
  GND 0.152: v15.88,35.56 13.97,37.47 13.97,38.1 8.26,43.81 8.26,47.12 9.53,48.39 v9.53,48.26
  PWR 0.152: J6.7 15.24,30.48 15.24,34.92 v15.88,35.56
  Bottom 0.152: R11.2 15.88,29.84 J6.7
D0/RX  (via drill 0.33)
  Top 0.152: U1.20 4.23,27.3 v3.81,27.3 | v3.17,36.83 J5.4 | U5.26 13.95,43.84 v13.97,43.81
  PWR 0.152: v3.81,27.3 3.17,27.94 v3.17,36.83 3.17,42.04 4.19,43.05 5.71,43.05 5.97,43.31 12.06,43.31 12.57,43.81 v13.97,43.81
D1/TX  (via drill 0.33)
  Top 0.152: U1.21 4.16,26.67 3.17,26.67 v2.54,26.04 | U5.25 13.43,43.34 13.97,42.8 v14.1,42.93
  GND 0.152: v6.1,42.55 4.45,42.55 J5.3
  PWR 0.152: v2.54,26.04 2.54,38.1 J5.3 | v14.1,42.93 13.84,42.93 13.59,43.18 12.45,43.18 12.19,42.93 6.48,42.93 v6.1,42.55
D2/SDA
  Top 0.152: U1.19 4.3,27.94 3.17,27.94 1.91,29.21 J5.7
D3/SCL  (via drill 0.33)
  Top 0.152: U1.18 4.37,28.57 v3.81,28.57 3.17,29.21 3.17,34.29 4.45,35.56 LOAD/OTA.3
  Bottom 0.152: v3.81,28.57 1.91,26.67 J5.8
D4*
  Top 0.152: U1.25 5.12,23.11 4.45,23.11 3.43,24.13 J5.9
D5*
  Top 0.152: U1.31 6.57,20.32 2.54,20.32 J5.10
D6*  (via drill 0.33)
  Top 0.152: U1.27 5.77,22.35 3.3,22.35 v3.17,22.23
  GND 0.152: J5.11 1.27,20.07 3.17,21.97 v3.17,22.23
D7  (via drill 0.33)
  Top 0.152: v13.97,24.64 13.72,24.64 13.06,25.17 13.06,25.4 U1.1
  GND 0.152: J5.12 2.41,17.65 2.41,20.57 3.68,21.84 6.1,21.84 6.99,20.95 6.99,18.41 8.89,16.51 12.57,16.51 v12.7,16.64
  PWR 0.152: v12.7,16.64 12.7,22.99 13.97,24.26 v13.97,24.64
D+  (via drill 0.33)
  Top 0.152: RN1.2 8.89,9.79 CN1.D+ 8.89,5.46 v9.53,4.83
  Bottom 0.152: v9.53,4.83 Z1.1
D-  (via drill 0.33)
  Top 0.152: RN1.1 8.09,9.79 CN1.D- 8.09,4.99 v8.26,4.83
  Bottom 0.152: v8.26,4.83 8.26,5.35 Z2.1
ESP_RST  (via drill 0.33)
  Top 0.152: U5.8 v6.99,47.38 6.17,47.38 R14.2 4.53,48.77 4.53,49.49 RST.1
  GND 0.152: v14.86,35.56 13.34,37.08 13.34,38.1 7.87,43.56 7.87,46.5 v6.99,47.38
  PWR 0.152: J6.8 15.88,26.67 15.24,27.3 15.24,28.57 14.61,29.21 14.61,35.31 v14.86,35.56
GND  (via drill 0.33)
  Top 0.152: 10.41,44.32 10.54,45.47 U5.33 | v12.45,27.43 12.57,27.43 12.7,27.56
  Top 0.305: U1.15 7.28,27.77 8,27.05 8,25.65 U1.EXP | 9.6,24.77 U1.5 12.39,27.56 12.7,27.56 15.37,27.56 | 9.6,24.77 U1.EXP | U1.43 11.72,24.77 9.6,24.77 | U1.35 10.16,20.67 10.16,19.56 10.79,18.92 ON.C | U1.23 5.35,24.77 U1.EXP | C17.2 12.48,36.03 RESET.1 | U5.13 10.41,44.84 v10.41,45.47
  Top 0.61: v14.48,51.94 14.48,52.52 U$11.GND
  Bottom 0.305: R9.1 16.09,37.25 J6.4
  other vias: 14.35,10.29 14.61,18.92 3.68,10.16 5.59,12.7 11.3,2.54 14.48,4.45 3.56,4.57 7.49,37.97 2.16,48.64 13.34,30.99 15.88,27.94 15.88,40.64 5.08,14.73 11.18,9.65 16,45.72 13.46,51.18 13.46,50.29 13.46,52.07 11.3,52.07 1.91,27.94 4.45,33.4 8.26,33.4 3.81,44.07 5.84,37.59 7.62,51.69 7.62,51.05 7.62,50.42 7.62,49.78 11.18,45.47 11.18,44.7 10.41,44.7 2.79,48.01 2.79,46.74 12.06,33.4 11.18,36.07 11.81,15.37 11.43,17.65 11.18,35.31 11.3,33.4
  pour Bottom (isolate 0.406): 19.68,52.07 -1.91,52.07 -1.91,-1.91 19.68,-1.91
  pour Top (isolate 0.406): -2.54,52.07 20.32,52.07 20.32,-2.54 -2.54,-2.54
  pour GND (isolate 0.406): -0.64,52.07 18.41,52.07 18.41,-0.64 -0.64,-0.64
HWB
  Top 0.152: R4.1 7.62,19.96 U1.33
IO8  (via drill 0.33)
  Top 0.178: U1.28 6.1,21.97 4.83,21.97 v3.81,20.95
  GND 0.178: v3.81,20.95 2.79,19.94 2.79,15.49 J5.13
IO9*  (via drill 0.33)
  Top 0.178: U1.29 6.86,22.1 6.35,21.59 5.21,21.59 4.95,21.34 v4.95,20.95
  GND 0.178: v4.95,20.95 4.45,20.45 4.45,19.3 3.17,18.03 3.17,13.34 J5.14
IO10*  (via drill 0.33)
  Top 0.178: U1.30 7.14,21.74 6.35,20.95 v5.97,20.95
  GND 0.178: v5.97,20.95 4.83,19.81 4.83,19.18 3.56,17.91 3.56,11.18 J5.15
IO11*  (via drill 0.33)
  Top 0.152: U1.12 8.34,29.63 v8.26,29.72
  PWR 0.152: v8.26,29.72 8.13,29.84 5.71,29.84 5.08,29.21 5.08,27.43 4.19,26.54 3.68,26.54 3.17,26.04 3.17,25.4 2.79,25.02 2.79,23.75 3.81,22.73 3.81,21.97 2.41,20.57 2.41,7.49 J5.16
IO12*  (via drill 0.33)
  Top 0.152: U1.26 5.44,22.73 4.06,22.73 3.94,22.86 v2.54,22.86
  Bottom 0.152: v2.54,22.86 2.54,5.08 J5.17
IO13
  Top 0.152: J6.17 15.24,5.08 15.24,8.13 14.61,8.76 14.1,8.76 13.34,9.53 R8.1 12.48,12.06 10.16,12.06 8.89,13.34 7.24,13.34 6.6,13.97 6.6,19.56 7.99,20.94 U1.32
MISO  (via drill 0.33)
  Top 0.152: U1.11 9.4,28.83 8.89,29.34 8.89,31.11 v9.53,31.75
  Bottom 0.152: v9.53,31.75 10.16,31.11 10.79,31.11 11.18,31.5 11.18,32.38 10.41,33.15 10.41,36.45 12.95,38.99 12.95,39.62 15.24,41.91 J6.2
MOSI  (via drill 0.33)
  Top 0.152: U1.10 10.03,28.74 10.03,30.1 v9.65,30.48 | J5.1 2.54,43.18 2.54,42.09
  Bottom 0.152: v9.65,30.48 9.53,30.48 3.81,36.2 3.81,37.47 2.92,38.35 2.92,42.8 J5.1
N$2
  Top 0.152: R7.2 14.19,31.65 RX.A
N$3
  Top 0.152: R5.2 ON.A
N$4
  Top 0.152: R6.2 TX.A
N$6  (via drill 0.33)
  Top 0.152: U5.15 7.09,43.84 v6.86,44.07 | v6.86,39.24 6.86,36.89 | R10.1 6.92,36.83 6.86,36.89 | LOAD/OTA.2 5.71,36.32 6.22,36.83 6.8,36.83 6.86,36.89
  PWR 0.152: v6.86,44.07 6.86,44.96 6.22,45.59 6.22,51.31 v6.35,51.44
  Bottom 0.152: v6.86,44.07 6.86,43.05 6.73,42.93 6.73,39.88 6.86,39.75 v6.86,39.24 | v6.35,51.44 TP3.TP
N$7
  Top 0.152: R8.2 L.A
N$27
  Top 0.152: C17.1 14.19,38.15 Y1.1 13.34,39.15 13.34,41.15 13.72,41.53 14.86,41.53 15.24,41.91 15.24,44.45 14.86,44.84 U5.28
N$28
  Top 0.152: C16.1 12.11,40.22 Y1.3 | Y1.3 12.71,40.52 | Y1.3 12.41,40.73 13.59,41.91 14.73,41.91 14.86,42.04 14.86,44.07 14.48,44.45 13.59,44.45 13.47,44.34 U5.27
N$31
  Top 0.61: U$11.RF 12.45,51.31 12.31,51.17 12.18,51.17 12.06,51.05 12.05,51.02 C18.1
  Top 0.813: L4.1 12.06,50.93 C18.1
N$32
  Top 0.152: U5.31 13.82,46.34 16.26,48.77 16.26,48.9 16.04,48.68 R3.1
N$33  (via drill 0.33)
  Top 0.152: U5.32 13.22,46.88 13.86,46.88 15.24,48.26 v15.24,49.15 | RST.2 6.48,49.53 v7.87,48.13
  PWR 0.152: v15.24,49.15 8.26,49.15 7.87,48.77 v7.87,48.13
N$34
  Top 0.152: U5.21 11.04,41.87 R13.2
N$35  (via drill 0.33)
  Top 0.152: R13.1 9.4,38.48 9.18,38.27 8.09,38.27 7.62,38.73 7.62,40.51 v7.75,40.64
  Bottom 0.152: v7.75,40.64 8.38,41.27 U6.6
N$36  (via drill 0.33)
  Top 0.152: U5.20 10.54,42.17 9.4,41.02 8.76,41.02 8.51,40.77 8.51,39.24 v8.26,38.99
  Bottom 0.152: v8.26,38.99 8.26,38.86 8,38.61 5.21,38.61 5.12,38.86 U6.1
N$37  (via drill 0.33)
  Top 0.152: U5.18 9.54,42.44 9.14,42.04 v8.26,42.04
  Bottom 0.152: v8.26,42.04 8,42.04 7.11,41.15 7.11,40.26 7.37,40.01 U6.7
N$38  (via drill 0.33)
  Top 0.152: U5.19 10.04,42.43 9.02,41.4 6.22,41.4 v6.1,41.27
  Bottom 0.152: v6.1,41.27 U6.3
N$39  (via drill 0.33)
  Top 0.152: U5.23 12.04,42.44 12.32,42.16 12.95,42.16 v13.21,42.42
  Bottom 0.152: U6.5 13.08,42.55 v13.21,42.42
N$40  (via drill 0.33)
  Top 0.152: U5.22 11.54,42.05 v11.81,41.78
  PWR 0.152: v11.81,41.78 9.14,41.78 8.76,41.4 7.49,41.4 v6.1,40.01
  Bottom 0.152: v6.1,40.01 U6.2
N$45
  Top 0.305: U5.2 12.04,49.3 C18.2
  Top 0.813: L5.1 12.06,49.4 C18.2
RD+  (via drill 0.33)
  Top 0.152: RN1.3 8.65,12.05 v8.26,12.45 | U1.4 12.34,26.8 12.7,26.8 13.08,27.18 14.1,27.18 v14.48,26.8
  PWR 0.152: v8.26,12.45 8.26,12.7 8.89,13.34 8.89,16.51 12.06,19.68 12.06,24 14.48,26.42 v14.48,26.8
RD-  (via drill 0.33)
  Top 0.152: RN1.4 7.24,12.19 v7.24,12.45 | U1.3 12.3,26.02 12.7,26.42 13.21,26.42 v13.34,26.54
  PWR 0.152: v7.24,12.45 8.26,13.46 8.26,16.51 11.43,19.68 11.43,24.64 v13.34,26.54
RESET  (via drill 0.33)
  Top 0.152: 10.16,32.38 11.81,32.38 12.06,32.64 13.59,32.64 13.97,33.02 13.97,33.44 14.02,33.44 | 10.16,32.38 8.89,32.38 8.51,32 8.51,30.86 8.38,30.73 7.87,30.73 7.62,30.48 7.62,28.86 U1.13 | RESET.4 10.06,32.48 10.16,32.38 | 14.02,33.44 15.66,33.44 J6.5 | 14.02,33.44 RESET.2 | v8.26,34.29 6.99,35.56 LOAD/OTA.1
  GND 0.152: J5.5 v8.26,34.29 J6.5
  Bottom 0.152: J6.5 14.19,34.29 R1.2
RXLED/SS  (via drill 0.33)
  Top 0.152: U1.8 10.79,28.08 10.79,29.21 11.56,29.97 | 11.56,29.97 R7.1 | 11.56,29.97 11.56,30.48 v11.3,30.73
  Bottom 0.152: v11.3,30.73 11.18,30.73 10.16,29.72 9.14,29.72 8.51,30.35 8.51,30.86 3.81,35.56 3.17,35.56 2.54,36.2 2.54,40.64 J5.2
SCK  (via drill 0.33)
  Top 0.152: U1.9 10.41,28.41 10.41,31.62 v10.54,31.75
  Bottom 0.152: v10.54,31.75 10.54,32.51 10.03,33.02 10.03,36.58 12.57,39.12 12.57,40.51 J6.1
TXLED  (via drill 0.33)
  Top 0.152: U1.22 4.34,25.78 v3.81,25.78 | v3.81,19.68 R6.1
  Bottom 0.152: v3.81,25.78 2.89,24.86 2.89,24.41 3.81,23.5 3.81,21.97 3.05,21.21 3.05,19.94 3.3,19.68 v3.81,19.68
UCAP
  Top 0.152: U1.6 12.06,27.94 C5.1
VIN  (via drill 0.33)
  PWR 0.305: J6.3 13.46,36.32 13.46,32.38 14.1,31.75 14.1,30.1 10.67,26.67 10.67,20.19 7.62,17.14 v7.62,13.97
  Bottom 0.305: R9.2 16.09,38.95 J6.3 | U3.3 8.66,15.01 v7.62,13.97 7.83,13.76 C4.1 10.79,12.47 T1.3
VUSB  (via drill 0.33)
  Top 0.152: U1.7 11.36,27.94 11.43,27.94 v11.43,28.83
  Bottom 0.152: v11.43,28.83 13.97,28.83 15.49,27.3 15.49,10.41 14.61,9.53 T1.1
  Bottom 0.305: F1.2 12.87,5.67 C9.1 | R2.2 C9.1 | C9.1 14.39,6.13 14.61,6.35 14.61,8.89 13.97,9.53 T1.1
VUSBD  (via drill 0.33)  (1 unrouted)
  Top 0.305: CN1.VBUS 7.29,7.95 5.71,9.53 4.32,9.53 v3.94,9.14
  Bottom 0.305: 6.48,2.41 5.08,3.81 5.08,6.13 3.94,7.28 v3.94,9.14 | F1.1 6.48,2.41 | 5.97,1.91 6.48,2.41
XTAL1
  Top 0.152: U1.17 | U1.17 6.35,27.3 6.1,27.3 3.81,29.59 3.81,31.68 Q1.P$3
XTAL2
  Top 0.152: U1.16 6.86,27.43 6.48,27.81 6.1,27.81 5.62,28.29 5.62,29.88 6.28,30.54 Q1.P$1

### Text on the board
tPlace: MOSI | SCK | SS | MISO | TX1 | VIN | RX1 | GND | RST | RST | GND | 5V | RX | D2 | EN | rst | D3 | D4 | # | A5 | # | D5 | A4 | D6 | # | A3 | D7 | PWR | L | A2 | D8 | A1 | TX | # | D9 | A0 | D10 | # | REF | # | D11 | 3V3 | D12 | # | # | D13
tNames: Arachnio r1 / (c) 2015 / CC-BY-SA-3.0